# Altium schematic sheet MCU.SchDoc: MCU
size A3; Date: 9/24/2014; Author: P.A.; CompanyName: STMicroelectronics; Organization: Microcontrollers Division; Address1: 12, Rue Jules HOROWITZ; Address2: 38019 Grenoble; Address3: FRANCE; DocumentNumber: MB1189; Revision: B-07; SheetNumber: 2; SheetTotal: 12; Project: STM32F469I-DISCO
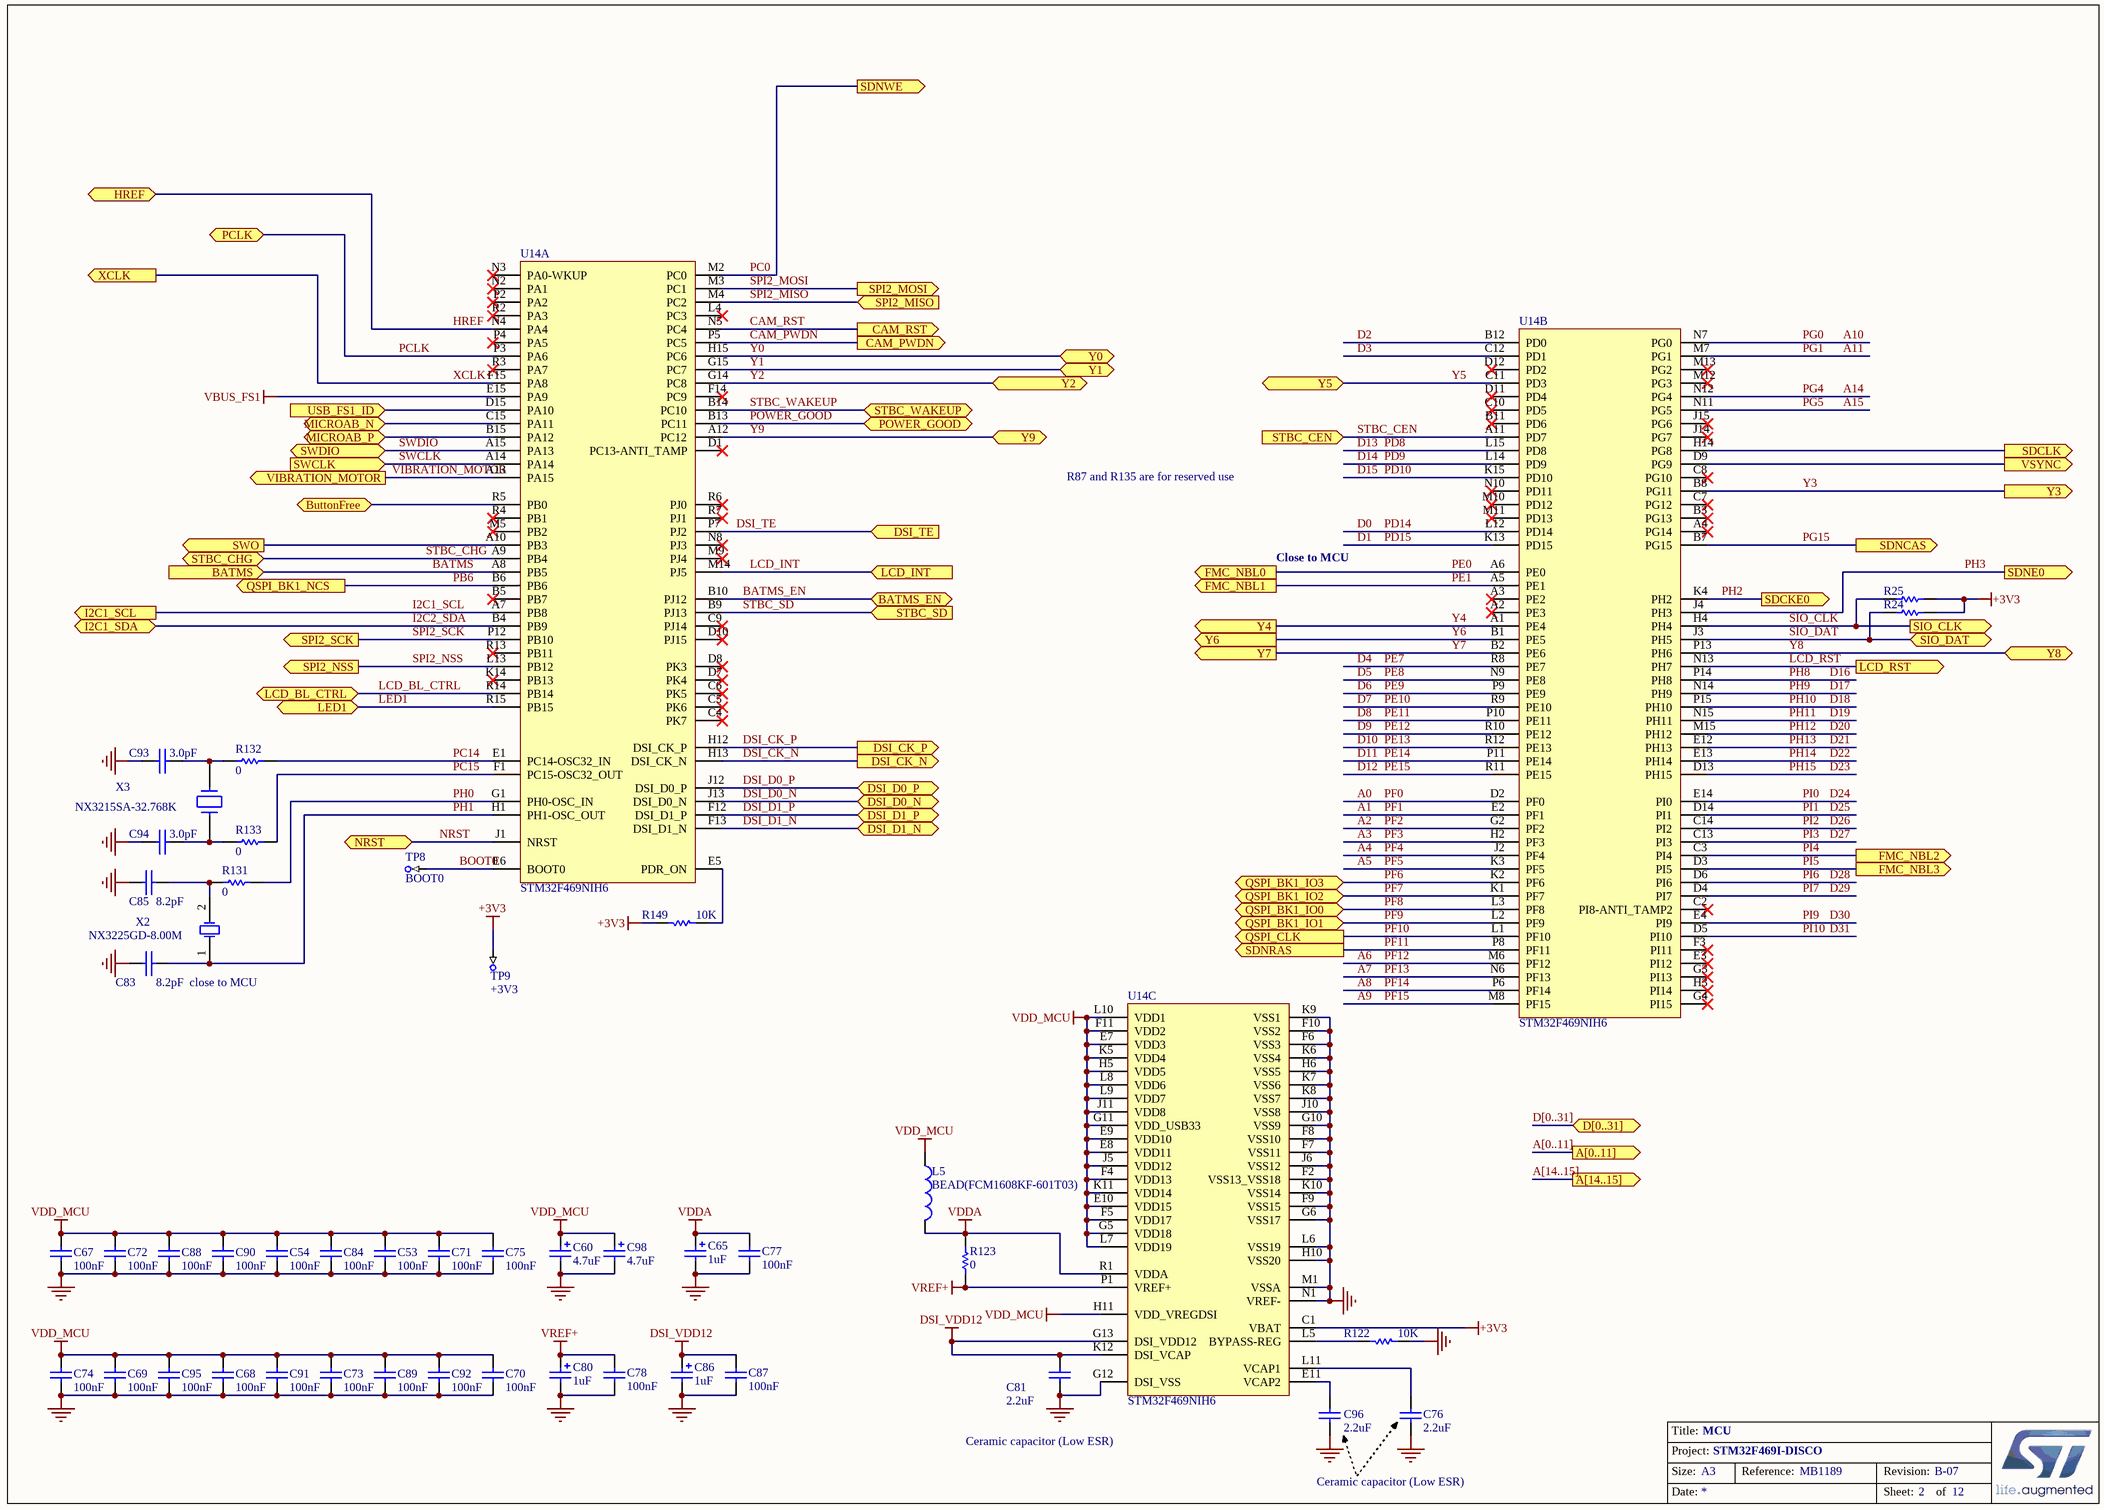
[diagram p0: MCU.SchDoc]

## Parts
C53  100nF  [CAP - 0402]
C54  100nF  [CAP - 0402]
C60  4.7uF  [A]
C65  1uF  [A]
C67  100nF  [CAP - 0402]
C68  100nF  [CAP - 0402]
C69  100nF  [CAP - 0402]
C70  100nF  [CAP - 0402]
C71  100nF  [CAP - 0402]
C72  100nF  [CAP - 0402]
C73  100nF  [CAP - 0402]
C74  100nF  [CAP - 0402]
C75  100nF  [CAP - 0402]
C76  2.2uF  [CAP - 0402]
C77  100nF  [CAP - 0402]
C78  100nF  [CAP - 0402]
C80  1uF  [A]
C81  2.2uF  [CAP - 0402]
C83  8.2pF  [CAP - 0603]
C84  100nF  [CAP - 0402]
C85  8.2pF  [CAP - 0603]
C86  1uF  [A]
C87  100nF  [CAP - 0402]
C88  100nF  [CAP - 0402]
C89  100nF  [CAP - 0402]
C90  100nF  [CAP - 0402]
C91  100nF  [CAP - 0402]
C92  100nF  [CAP - 0402]
C93  3.0pF  [CAP - 0603]
C94  3.0pF  [CAP - 0603]
C95  100nF  [CAP - 0402]
C96  2.2uF  [CAP - 0402]
C98  4.7uF  [A]
L5  BEAD(FCM1608KF-601T03)  [1608[0603]]
R24  4K7  [RES - 0402]  (value not drawn)
R25  4K7  [RES - 0402]  (value not drawn)
R122  10K  [RES - 0402]
R123  0  [RES - 0402]
R131  0  [RES - 0402]
R132  0  [RES - 0402]
R133  0  [RES - 0402]
R149  10K  [RES - 0402]
TP8  BOOT0  [PIN HEADER 1p]  (no BOM)
TP9  +3V3  [PIN HEADER 1p]  (no BOM)
U14  STM32F469NIH6  [STM-TFBGA216]  (parts A,B,C of 3)
X2  NX3225GD-8.00M  [RESC3226X100N]
X3  NX3215SA-32.768K  [NX3215SA]

## Ports
A[0..11] (out), A[14..15] (out), BATMS (in), BATMS_EN (bidir), ButtonFree, CAM_PWDN (out), CAM_RST (out), D[0..31] (bidir), DSI_CK_N (out), DSI_CK_P (out), DSI_D0_N (bidir), DSI_D0_P (bidir), DSI_D1_N (bidir), DSI_D1_P (bidir), DSI_TE (in), FMC_NBL0 (out), FMC_NBL1 (out), FMC_NBL2 (out), FMC_NBL3 (out), HREF (bidir), I2C1_SCL (out), I2C1_SDA (bidir), LCD_BL_CTRL, LCD_INT (in), LCD_RST (out), LED1 (bidir), MICROAB_N, MICROAB_P, NRST (bidir), PCLK (bidir), POWER_GOOD (bidir), QSPI_BK1_IO0 (bidir), QSPI_BK1_IO1 (bidir), QSPI_BK1_IO2 (bidir), QSPI_BK1_IO3 (bidir), QSPI_BK1_NCS (out), QSPI_CLK (out), SDCKE0 (out), SDCLK (out), SDNCAS (out), SDNE0 (out), SDNRAS (out), SDNWE (out), SIO_CLK (out), SIO_DAT (bidir), SPI2_MISO (in), SPI2_MOSI (out), SPI2_NSS (out), SPI2_SCK (out), STBC_CEN (in), STBC_CHG (bidir), STBC_SD (in), STBC_WAKEUP (bidir), SWCLK (in), SWDIO, SWO (out), USB_FS1_ID (in), VIBRATION_MOTOR (out), VSYNC (out), XCLK (out), Y0 (bidir), Y1 (bidir), Y2 (bidir), Y3 (out), Y4 (out), Y5 (bidir), Y6 (out), Y7 (out), Y8 (bidir), Y9 (bidir)

## Nets
+3V3: R24.1 R25.1 R149.2 TP9.1 U14.C1(VBAT)
DSI_VDD12: C81.1 C86.1 C87.2 U14.G13(DSI_VDD12) U14.K12(DSI_VCAP)
GND: C53.2 C54.2 C60.2 C65.2 C67.2 C68.2 C69.2 C70.2 C71.2 C72.2 C73.2 C74.2 C75.2 C76.2 C77.1 C78.1 C80.2 C81.2 C83.2 C84.2 C85.2 C86.2 C87.1 C88.2 C89.2 C90.2 C91.2 C92.2 C93.2 C94.2 C95.2 C96.2 C98.2 R122.1 U14.F2(VSS13_VSS18) U14.F6(VSS3) U14.F7(VSS11) U14.F8(VSS10) U14.F9(VSS15) U14.F10(VSS2) U14.G6(VSS17) U14.G10(VSS9) U14.G12(DSI_VSS) U14.H6(VSS5) U14.H10(VSS20) U14.J6(VSS12) U14.J10(VSS8) U14.K6(VSS4) U14.K7(VSS6) U14.K8(VSS7) U14.K9(VSS1) U14.K10(VSS14) U14.L6(VSS19) U14.M1(VSSA) U14.N1(VREF-)
VBUS_FS1: U14.E15(PA9)
VDD_MCU: C53.1 C54.1 C60.1 C67.1 C68.1 C69.1 C70.1 C71.1 C72.1 C73.1 C74.1 C75.1 C84.1 C88.1 C89.1 C90.1 C91.1 C92.1 C95.1 C98.1 L5.1 U14.E7(VDD3) U14.E8(VDD11) U14.E9(VDD10) U14.E10(VDD15) U14.F4(VDD13) U14.F5(VDD17) U14.F11(VDD2) U14.G5(VDD18) U14.G11(VDD_USB33) U14.H5(VDD5) U14.H11(VDD_VREGDSI) U14.J5(VDD12) U14.J11(VDD8) U14.K5(VDD4) U14.K11(VDD14) U14.L7(VDD19) U14.L8(VDD6) U14.L9(VDD7) U14.L10(VDD1)
VDDA: C65.1 C77.2 L5.2 R123.1 U14.R1(VDDA)
VREF+: C78.2 C80.1 R123.2 U14.P1(VREF+)
A0: U14.D2(PF0)  [also labelled PF0]
A1: U14.E2(PF1)  [also labelled PF1]
A2: U14.G2(PF2)  [also labelled PF2]
A3: U14.H2(PF3)  [also labelled PF3]
A4: U14.J2(PF4)  [also labelled PF4]
A5: U14.K3(PF5)  [also labelled PF5]
A6: U14.M6(PF12)  [also labelled PF12]
A7: U14.N6(PF13)  [also labelled PF13]
A8: U14.P6(PF14)  [also labelled PF14]
A9: U14.M8(PF15)  [also labelled PF15]
A10: U14.N7(PG0)  [also labelled PG0]
A11: U14.M7(PG1)  [also labelled PG1]
A14: U14.N12(PG4)  [also labelled PG4]
A15: U14.N11(PG5)  [also labelled PG5]
BATMS: U14.A8(PB5) ; port BATMS
BATMS_EN: U14.B10(PJ12) ; port BATMS_EN
BOOT0: TP8.1 U14.E6(BOOT0)
ButtonFree: U14.R5(PB0) ; port ButtonFree
CAM_PWDN: U14.P5(PC5) ; port CAM_PWDN
CAM_RST: U14.N5(PC4) ; port CAM_RST
D0: U14.L12(PD14)  [also labelled PD14]
D1: U14.K13(PD15)  [also labelled PD15]
D2: U14.B12(PD0)
D3: U14.C12(PD1)
D4: U14.R8(PE7)  [also labelled PE7]
D5: U14.N9(PE8)  [also labelled PE8]
D6: U14.P9(PE9)  [also labelled PE9]
D7: U14.R9(PE10)  [also labelled PE10]
D8: U14.P10(PE11)  [also labelled PE11]
D9: U14.R10(PE12)  [also labelled PE12]
D10: U14.R12(PE13)  [also labelled PE13]
D11: U14.P11(PE14)  [also labelled PE14]
D12: U14.R11(PE15)  [also labelled PE15]
D13: U14.L15(PD8)  [also labelled PD8]
D14: U14.L14(PD9)  [also labelled PD9]
D15: U14.K15(PD10)  [also labelled PD10]
D16: U14.P14(PH8)  [also labelled PH8]
D17: U14.N14(PH9)  [also labelled PH9]
D18: U14.P15(PH10)  [also labelled PH10]
D19: U14.N15(PH11)  [also labelled PH11]
D20: U14.M15(PH12)  [also labelled PH12]
D21: U14.E12(PH13)  [also labelled PH13]
D22: U14.E13(PH14)  [also labelled PH14]
D23: U14.D13(PH15)  [also labelled PH15]
D24: U14.E14(PI0)  [also labelled PI0]
D25: U14.D14(PI1)  [also labelled PI1]
D26: U14.C14(PI2)  [also labelled PI2]
D27: U14.C13(PI3)  [also labelled PI3]
D28: U14.D6(PI6)  [also labelled PI6]
D29: U14.D4(PI7)  [also labelled PI7]
D30: U14.E4(PI9)  [also labelled PI9]
D31: U14.D5(PI10)  [also labelled PI10]
DSI_CK_N: U14.H13(DSI_CK_N) ; port DSI_CK_N
DSI_CK_P: U14.H12(DSI_CK_P) ; port DSI_CK_P
DSI_D0_N: U14.J13(DSI_D0_N) ; port DSI_D0_N
DSI_D0_P: U14.J12(DSI_D0_P) ; port DSI_D0_P
DSI_D1_N: U14.F13(DSI_D1_N) ; port DSI_D1_N
DSI_D1_P: U14.F12(DSI_D1_P) ; port DSI_D1_P
DSI_TE: U14.P7(PJ2) ; port DSI_TE
HREF: U14.N4(PA4) ; port HREF
I2C1_SCL: U14.A7(PB8) ; port I2C1_SCL
I2C2_SDA: U14.B4(PB9) ; port I2C1_SDA
LCD_BL_CTRL: U14.R14(PB14) ; port LCD_BL_CTRL
LCD_INT: U14.M14(PJ5) ; port LCD_INT
LCD_RST: U14.N13(PH7) ; port LCD_RST
LED1: U14.R15(PB15) ; port LED1
MICROAB_N: U14.C15(PA11) ; port MICROAB_N
MICROAB_P: U14.B15(PA12) ; port MICROAB_P
NRST: U14.J1(NRST) ; port NRST
PB6: U14.B6(PB6) ; port QSPI_BK1_NCS
PC0: U14.M2(PC0) ; port SDNWE
PC14: R132.2 U14.E1(PC14-OSC32_IN)
PC15: R133.2 U14.F1(PC15-OSC32_OUT)
PCLK: U14.P3(PA6) ; port PCLK
PE0: U14.A6(PE0) ; port FMC_NBL0
PE1: U14.A5(PE1) ; port FMC_NBL1
PF6: U14.K2(PF6) ; port QSPI_BK1_IO3
PF7: U14.K1(PF7) ; port QSPI_BK1_IO2
PF8: U14.L3(PF8) ; port QSPI_BK1_IO0
PF9: U14.L2(PF9) ; port QSPI_BK1_IO1
PF10: U14.L1(PF10) ; port QSPI_CLK
PF11: U14.P8(PF11) ; port SDNRAS
PG15: U14.B7(PG15) ; port SDNCAS
PH0: R131.1 U14.G1(PH0-OSC_IN)
PH1: C83.1 U14.H1(PH1-OSC_OUT) X2.1(OSC1)
PH2: U14.K4(PH2) ; port SDCKE0
PH3: U14.J4(PH3) ; port SDNE0
PI4: U14.C3(PI4) ; port FMC_NBL2
PI5: U14.D3(PI5) ; port FMC_NBL3
POWER_GOOD: U14.B13(PC11) ; port POWER_GOOD
SDCLK: U14.H14(PG8) ; port SDCLK
SIO_CLK: R25.2 U14.H4(PH4) ; port SIO_CLK
SIO_DAT: R24.2 U14.J3(PH5) ; port SIO_DAT
SPI2_MISO: U14.M4(PC2) ; port SPI2_MISO
SPI2_MOSI: U14.M3(PC1) ; port SPI2_MOSI
SPI2_NSS: U14.L13(PB12) ; port SPI2_NSS
SPI2_SCK: U14.P12(PB10) ; port SPI2_SCK
STBC_CEN: U14.A11(PD7) ; port STBC_CEN
STBC_CHG: U14.A9(PB4) ; port STBC_CHG
STBC_SD: U14.B9(PJ13) ; port STBC_SD
STBC_WAKEUP: U14.B14(PC10) ; port STBC_WAKEUP
SWCLK: U14.A14(PA14) ; port SWCLK
SWDIO: U14.A15(PA13) ; port SWDIO
SWO: U14.A10(PB3) ; port SWO
USB_FS1_ID: U14.D15(PA10) ; port USB_FS1_ID
VIBRATION_MOTOR: U14.A13(PA15) ; port VIBRATION_MOTOR
VSYNC: U14.D9(PG9) ; port VSYNC
XCLK: U14.F15(PA8) ; port XCLK
Y0: U14.H15(PC6) ; port Y0
Y1: U14.G15(PC7) ; port Y1
Y2: U14.G14(PC8) ; port Y2
Y3: U14.B8(PG11) ; port Y3
Y4: U14.A1(PE4) ; port Y4
Y5: U14.C11(PD3) ; port Y5
Y6: U14.B1(PE5) ; port Y6
Y7: U14.B2(PE6) ; port Y7
Y8: U14.P13(PH6) ; port Y8
Y9: U14.A12(PC12) ; port Y9
NetC76_1: C76.1 U14.L11(VCAP1)
NetC85_1: C85.1 R131.2 X2.2(OSC2)
NetC93_1: C93.1 R132.1 X3.1
NetC94_1: C94.1 R133.1 X3.2
NetC96_1: C96.1 U14.E11(VCAP2)
NetR122_2: R122.2 U14.L5(BYPASS-REG)
NetR149_1: R149.1 U14.E5(PDR_ON)

Not connected (* = marked no-connect by the designer): U14 A2(PE3)* A3(PE2)* A4(PG14)* B3(PG13)* B5(PB7)* B11(PD6)* C2(PI8-ANTI_TAMP2)* C4(PK7)* C5(PK6)* C6(PK5)* C7(PG12)* C8(PG10)* C9(PJ14)* C10(PD5)* D1(PC13-ANTI_TAMP)* D7(PK4)* D8(PK3)* D10(PJ15)* D11(PD4)* D12(PD2)* E3(PI12)* F3(PI11)* F14(PC9)* G3(PI13)* G4(PI15)* H3(PI14)* J14(PG7)* J15(PG6)* K14(PB13)* L4(PC3)* M5(PB2)* M9(PJ4)* M10(PD12)* M11(PD13)* M12(PG3)* M13(PG2)* N2(PA1)* N3(PA0-WKUP)* N8(PJ3)* N10(PD11)* P2(PA2)* P4(PA5)* R2(PA3)* R3(PA7)* R4(PB1)* R6(PJ0)* R7(PJ1)* R13(PB11)*

## Buses and harness runs
bus A[0..11] = port A[0..11]
bus A[14..15] = port A[14..15]
bus D[0..31] = port D[0..31]

## Notes on the sheet
- R87 and R135 are for reserved use
- Close to MCU
- close to MCU
- Ceramic capacitor (Low ESR)
- Title:
- Project:
- Size:
- Date:
- A3
- Reference:
- Sheet:
- Revision:
- of

## Library data of the parts
C53 C54 C67-C75 C83-C85 C88-C95 = CAP: Capacitor; Ordered by: Subcon
  C53 C54 C67-C75 C84 C88-C92 C95: Published: 8-Jun-2000; Revision: July-2002: Re-released for DXP Platform.; Publisher: Altium Limited; Value: 100nF
C60 C98 = Cap Pol1: Polarized Capacitor (Radial); Value: 47uF; Ordered by: Subcon; Published: 8-Jun-2000; Revision: July-2002: Re-released for DXP Platform.; Publisher: Altium Limited
C65 C80 C86 = Cap Pol1: Polarized Capacitor (Radial); Value: 10uF; Ordered by: Subcon; Published: 8-Jun-2000; Revision: July-2002: Re-released for DXP Platform.; Publisher: Altium Limited
C76-C78 C81 C87 C96 = Cap: Capacitor; Value: 10nF; Ordered by: Subcon; Published: 8-Jun-2000; Revision: July-2002: Re-released for DXP Platform.; Publisher: Altium Limited
L5 = Inductor: Value: 100uH; Ordered by: Subcon; Published: 8-Jun-2000; Revision: July-2002: Re-released for DXP Platform.; Publisher: Altium Limited
R24 R25 R122 R123 R131-R133 R149 = Res1: Resistor; Value: 1K; Ordered by: Subcon; Published: 8-Jun-2000; Revision: July-2002: Re-released for DXP Platform.; Publisher: Altium Limited
TP8 TP9 = TestPin
U14 = Manta_Dragon_TFBGA216: Manuf_Part_1: STM32F469NIH6U cut 1.0; Ordered by: ST; Ref St: 9175177; ECCN_US/EU: 3A991A2/NEC; Manuf_1: ST
X2 = XTAL_8M_NX3225GD: Crystal 8Mhz, 8pF, -+50PPM, SMD; Manuf_1: NDK; Manuf_Part_1: NX3225GD 8MHz EXS00A-CG04874; Manuf_Part_2: NX3225GD-8.000M-STD-CRA-3; ECCN_US/EU: EAR99/NEC; NDK Ref: X3127326; Ref St: 9157029; Provided: ST; Order: NX3225GD 8MHz EXS00A-CG04874; Ordered by: ST
X3 = XTAL_32K_NX3215SA: Crystal 32.768kHz, 6pF, -+20PPM, R=50K, SMD; Manuf_1: NDK; Manuf_Part_1: NX3215SA 32.768KHz EXS00A-MU00525; ECCN_US/EU: EAR99/NEC; Ref St: 9157034; NDK Ref: X3101802; Provided: ST; Distrib: *; Order: NX3215SA 32.768KHz EXS00A-MU00525; Ordered by: ST